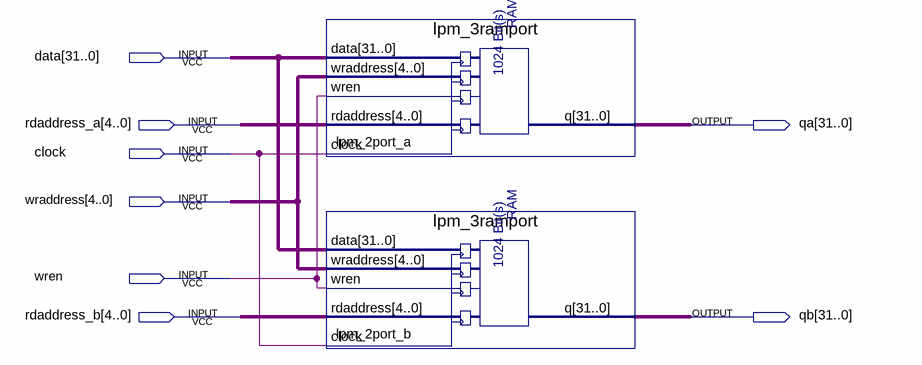
[diagram p0: schematic sheet]
// Quartus schematic ram3port.bdf as structural Verilog: 2 symbols, 8 pins
module ram3port (
  input  [31:0] data,
  input  [4:0] rdaddress_a,
  input  clock,
  input  [4:0] wraddress,
  input  wren,
  input  [4:0] rdaddress_b,
  output [31:0] qa,
  output [31:0] qb
);

  lpm_3ramport lpm_2port_a (
    .data(data), .wraddress(wraddress), .wren(wren), .rdaddress(rdaddress_a), .clock(clock), .q(qa));
  lpm_3ramport lpm_2port_b (
    .data(data), .wraddress(wraddress), .wren(wren), .rdaddress(rdaddress_b), .clock(clock), .q(qb));
endmodule
